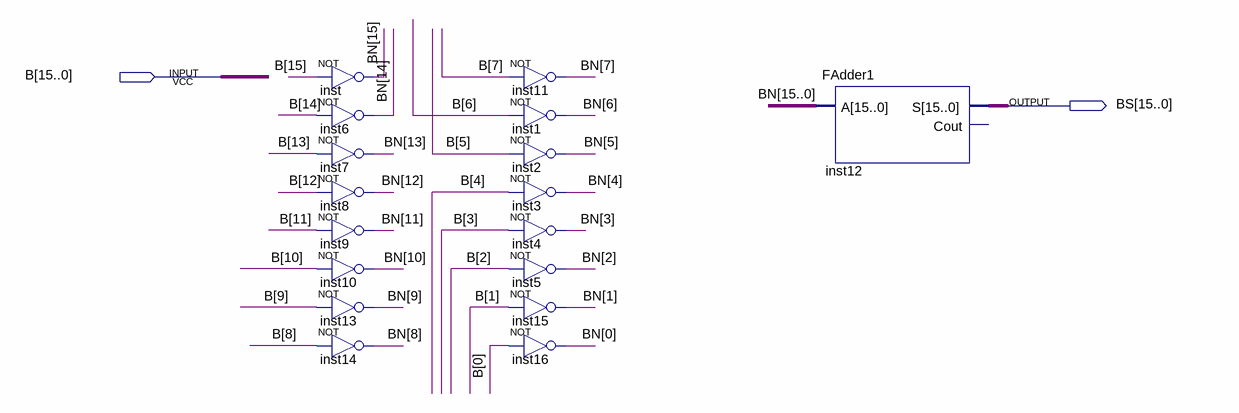
[diagram p0: schematic sheet]
// Quartus schematic Bu2.bdf as structural Verilog: 17 symbols, 2 pins
module Bu2 (
  input  [15:0] B,
  output [15:0] BS
);

  wire [15:0] BN;

  not inst (BN[15], B[15]);
  not inst6 (BN[14], B[14]);
  not inst7 (BN[13], B[13]);
  not inst8 (BN[12], B[12]);
  not inst9 (BN[11], B[11]);
  not inst10 (BN[10], B[10]);
  not inst13 (BN[9], B[9]);
  not inst14 (BN[8], B[8]);
  not inst11 (BN[7], B[7]);
  not inst1 (BN[6], B[6]);
  not inst2 (BN[5], B[5]);
  not inst3 (BN[4], B[4]);
  not inst4 (BN[3], B[3]);
  not inst5 (BN[2], B[2]);
  not inst15 (BN[1], B[1]);
  not inst16 (BN[0], B[0]);
  FAdder1 inst12 (.A(BN), .S(BS));  // open: Cout
endmodule
